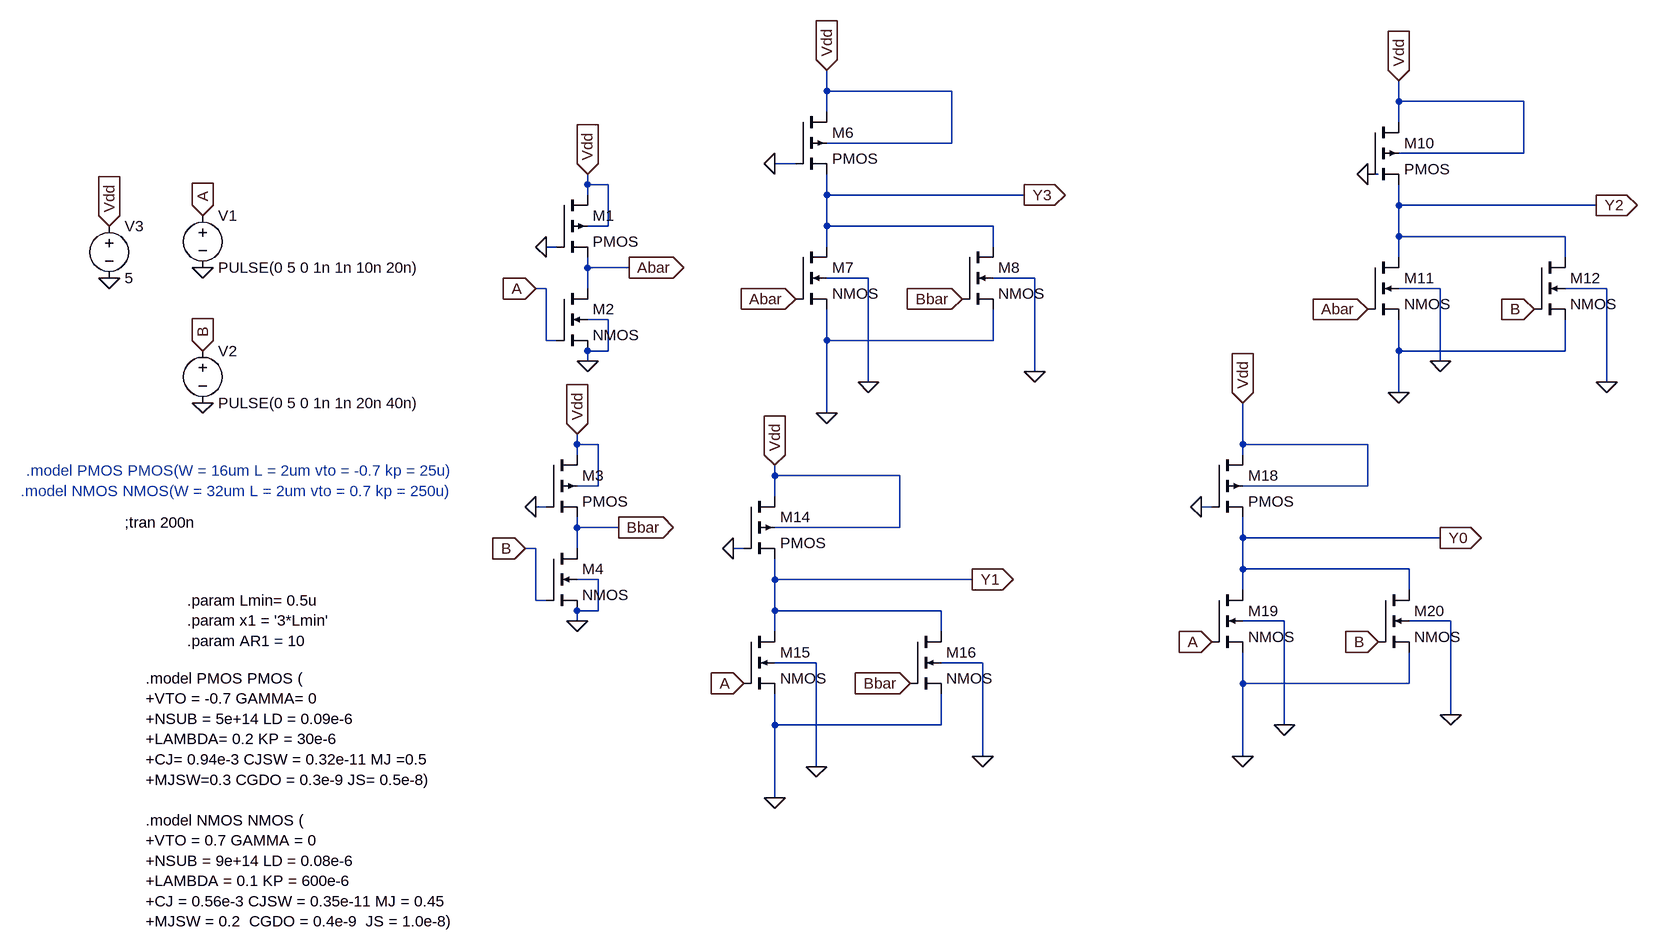
[diagram p0: schematic pseudo nmos 2x4 decoder.asc]
pseudo nmos 2x4 decoder.asc, the LTspice schematic file:
Version 4
SHEET 1 2552 1044
WIRE 928 -496 928 -528
WIRE 1120 -496 928 -496
WIRE 1808 -480 1808 -512
WIRE 2000 -480 1808 -480
WIRE 928 -464 928 -496
WIRE 1808 -448 1808 -480
WIRE 1120 -416 1120 -496
WIRE 1120 -416 928 -416
WIRE 2000 -400 2000 -480
WIRE 2000 -400 1808 -400
WIRE 880 -384 848 -384
WIRE 1776 -368 1760 -368
WIRE 560 -352 560 -368
WIRE 592 -352 560 -352
WIRE 560 -336 560 -352
WIRE 928 -336 928 -368
WIRE 1232 -336 928 -336
WIRE 1808 -320 1808 -352
WIRE 2112 -320 1808 -320
WIRE 592 -288 592 -352
WIRE 592 -288 560 -288
WIRE 928 -288 928 -336
WIRE 1184 -288 928 -288
WIRE 1808 -272 1808 -320
WIRE 2064 -272 1808 -272
WIRE 512 -256 496 -256
WIRE 928 -256 928 -288
WIRE 1184 -256 1184 -288
WIRE 1808 -240 1808 -272
WIRE 2064 -240 2064 -272
WIRE 560 -224 560 -240
WIRE 624 -224 560 -224
WIRE 992 -208 928 -208
WIRE 1248 -208 1184 -208
WIRE 496 -192 480 -192
WIRE 560 -192 560 -224
WIRE 1872 -192 1808 -192
WIRE 2128 -192 2064 -192
WIRE 592 -144 560 -144
WIRE 496 -112 496 -192
WIRE 512 -112 496 -112
WIRE 928 -112 928 -160
WIRE 1184 -112 1184 -160
WIRE 1184 -112 928 -112
WIRE 592 -96 592 -144
WIRE 592 -96 560 -96
WIRE 1808 -96 1808 -144
WIRE 2064 -96 2064 -144
WIRE 2064 -96 1808 -96
WIRE 560 -80 560 -96
WIRE 1872 -80 1872 -192
WIRE 1248 -64 1248 -208
WIRE 992 -48 992 -208
WIRE 2128 -48 2128 -192
WIRE 1808 -32 1808 -96
WIRE 928 0 928 -112
WIRE 544 48 544 32
WIRE 576 48 544 48
WIRE 1568 48 1568 -16
WIRE 1760 48 1568 48
WIRE 544 64 544 48
WIRE 1568 64 1568 48
WIRE 848 96 848 80
WIRE 1040 96 848 96
WIRE 576 112 576 48
WIRE 576 112 544 112
WIRE 1760 112 1760 48
WIRE 1760 112 1568 112
WIRE 848 128 848 96
WIRE 496 144 480 144
WIRE 1520 144 1504 144
WIRE 544 176 544 160
WIRE 608 176 544 176
WIRE 1040 176 1040 96
WIRE 1040 176 848 176
WIRE 1568 192 1568 160
WIRE 1872 192 1568 192
WIRE 480 208 464 208
WIRE 544 208 544 176
WIRE 800 208 784 208
WIRE 1568 240 1568 192
WIRE 1824 240 1568 240
WIRE 576 256 544 256
WIRE 848 256 848 224
WIRE 1152 256 848 256
WIRE 1568 272 1568 240
WIRE 1824 272 1824 240
WIRE 480 288 480 208
WIRE 496 288 480 288
WIRE 576 304 576 256
WIRE 576 304 544 304
WIRE 848 304 848 256
WIRE 1104 304 848 304
WIRE 544 320 544 304
WIRE 1632 320 1568 320
WIRE 1888 320 1824 320
WIRE 848 336 848 304
WIRE 1104 336 1104 304
WIRE 912 384 848 384
WIRE 1168 384 1104 384
WIRE 1568 416 1568 368
WIRE 1824 416 1824 368
WIRE 1824 416 1568 416
WIRE 1888 464 1888 320
WIRE 848 480 848 432
WIRE 1104 480 1104 432
WIRE 1104 480 848 480
WIRE 1632 480 1632 320
WIRE 1168 528 1168 384
WIRE 1568 528 1568 416
WIRE 912 544 912 384
WIRE 848 592 848 480
FLAG 560 -80 0
FLAG 480 -192 A
IOPIN 480 -192 In
FLAG 624 -224 Abar
IOPIN 624 -224 Out
FLAG 560 -368 Vdd
IOPIN 560 -368 In
FLAG -32 -96 B
IOPIN -32 -96 In
FLAG -32 -304 A
IOPIN -32 -304 In
FLAG -32 -224 0
FLAG -32 -16 0
FLAG 544 320 0
FLAG 464 208 B
IOPIN 464 208 In
FLAG 608 176 Bbar
IOPIN 608 176 Out
FLAG 544 32 Vdd
IOPIN 544 32 In
FLAG 928 -528 Vdd
IOPIN 928 -528 In
FLAG 880 -176 Abar
IOPIN 880 -176 In
FLAG 1136 -176 Bbar
IOPIN 1136 -176 In
FLAG 1232 -336 Y3
IOPIN 1232 -336 Out
FLAG -176 -288 Vdd
IOPIN -176 -288 In
FLAG -176 -208 0
FLAG 928 0 0
FLAG 992 -48 0
FLAG 1248 -64 0
FLAG 1808 -512 Vdd
IOPIN 1808 -512 In
FLAG 1760 -160 Abar
IOPIN 1760 -160 In
FLAG 2016 -160 B
IOPIN 2016 -160 In
FLAG 2112 -320 Y2
IOPIN 2112 -320 Out
FLAG 1808 -32 0
FLAG 1872 -80 0
FLAG 2128 -48 0
FLAG 848 80 Vdd
IOPIN 848 80 In
FLAG 800 416 A
IOPIN 800 416 In
FLAG 1056 416 Bbar
IOPIN 1056 416 In
FLAG 1152 256 Y1
IOPIN 1152 256 Out
FLAG 848 592 0
FLAG 912 544 0
FLAG 1168 528 0
FLAG 1568 -16 Vdd
IOPIN 1568 -16 In
FLAG 1520 352 A
IOPIN 1520 352 In
FLAG 1776 352 B
IOPIN 1776 352 In
FLAG 1872 192 Y0
IOPIN 1872 192 Out
FLAG 1568 528 0
FLAG 1632 480 0
FLAG 1888 464 0
FLAG 848 -384 0
FLAG 784 208 0
FLAG 1504 144 0
FLAG 1760 -368 0
FLAG 496 -256 0
FLAG 480 144 0
SYMBOL pmos4 512 -336 R0
SYMATTR InstName M1
SYMATTR Value2 l={Lmin} w={AR1*Lmin} ad={x1*AR1*Lmin} as={x1*AR1*Lmin} pd={2*x1 + 2*AR1*Lmin} ps={2*x1 + 2*AR1*Lmin}
SYMBOL nmos4 512 -192 R0
SYMATTR InstName M2
SYMATTR Value2 l={Lmin} w={AR1*Lmin} ad={x1*AR1*Lmin} as={x1*AR1*Lmin} pd={2*x1 + 2*AR1*Lmin} ps={2*x1 + 2*AR1*Lmin}
SYMBOL voltage -32 -320 R0
WINDOW 123 0 0 Left 0
WINDOW 39 0 0 Left 0
SYMATTR InstName V1
SYMATTR Value PULSE(0 5 0 1n 1n 10n 20n)
SYMBOL voltage -32 -112 R0
WINDOW 123 0 0 Left 0
WINDOW 39 0 0 Left 0
SYMATTR InstName V2
SYMATTR Value PULSE(0 5 0 1n 1n 20n 40n)
SYMBOL pmos4 496 64 R0
SYMATTR InstName M3
SYMATTR Value2 l={Lmin} w={AR1*Lmin} ad={x1*AR1*Lmin} as={x1*AR1*Lmin} pd={2*x1 + 2*AR1*Lmin} ps={2*x1 + 2*AR1*Lmin}
SYMBOL nmos4 496 208 R0
SYMATTR InstName M4
SYMATTR Value2 l={Lmin} w={AR1*Lmin} ad={x1*AR1*Lmin} as={x1*AR1*Lmin} pd={2*x1 + 2*AR1*Lmin} ps={2*x1 + 2*AR1*Lmin}
SYMBOL pmos4 880 -464 R0
SYMATTR InstName M6
SYMATTR Value2 l={Lmin} w={AR1*Lmin} ad={x1*AR1*Lmin} as={x1*AR1*Lmin} pd={2*x1 + 2*AR1*Lmin} ps={2*x1 + 2*AR1*Lmin}
SYMBOL nmos4 880 -256 R0
SYMATTR InstName M7
SYMATTR Value2 l={Lmin} w={2*AR1*Lmin} ad={x1*AR1*Lmin} as={x1*AR1*Lmin} pd={2*x1 + 2*AR1*Lmin} ps={2*x1 + 2*AR1*Lmin}
SYMBOL nmos4 1136 -256 R0
SYMATTR InstName M8
SYMATTR Value2 l={Lmin} w={2*AR1*Lmin} ad={x1*AR1*Lmin} as={x1*AR1*Lmin} pd={2*x1 + 2*AR1*Lmin} ps={2*x1 + 2*AR1*Lmin}
SYMBOL voltage -176 -304 R0
WINDOW 123 0 0 Left 0
WINDOW 39 0 0 Left 0
SYMATTR InstName V3
SYMATTR Value 5
SYMBOL pmos4 1760 -448 R0
SYMATTR InstName M10
SYMATTR Value2 l={Lmin} w={AR1*Lmin} ad={x1*AR1*Lmin} as={x1*AR1*Lmin} pd={2*x1 + 2*AR1*Lmin} ps={2*x1 + 2*AR1*Lmin}
SYMBOL nmos4 1760 -240 R0
SYMATTR InstName M11
SYMATTR Value2 l={Lmin} w={2*AR1*Lmin} ad={x1*AR1*Lmin} as={x1*AR1*Lmin} pd={2*x1 + 2*AR1*Lmin} ps={2*x1 + 2*AR1*Lmin}
SYMBOL nmos4 2016 -240 R0
SYMATTR InstName M12
SYMATTR Value2 l={Lmin} w={2*AR1*Lmin} ad={x1*AR1*Lmin} as={x1*AR1*Lmin} pd={2*x1 + 2*AR1*Lmin} ps={2*x1 + 2*AR1*Lmin}
SYMBOL pmos4 800 128 R0
SYMATTR InstName M14
SYMATTR Value2 l={Lmin} w={AR1*Lmin} ad={x1*AR1*Lmin} as={x1*AR1*Lmin} pd={2*x1 + 2*AR1*Lmin} ps={2*x1 + 2*AR1*Lmin}
SYMBOL nmos4 800 336 R0
SYMATTR InstName M15
SYMATTR Value2 l={Lmin} w={2*AR1*Lmin} ad={x1*AR1*Lmin} as={x1*AR1*Lmin} pd={2*x1 + 2*AR1*Lmin} ps={2*x1 + 2*AR1*Lmin}
SYMBOL nmos4 1056 336 R0
SYMATTR InstName M16
SYMATTR Value2 l={Lmin} w={2*AR1*Lmin} ad={x1*AR1*Lmin} as={x1*AR1*Lmin} pd={2*x1 + 2*AR1*Lmin} ps={2*x1 + 2*AR1*Lmin}
SYMBOL pmos4 1520 64 R0
SYMATTR InstName M18
SYMATTR Value2 l={Lmin} w={AR1*Lmin} ad={x1*AR1*Lmin} as={x1*AR1*Lmin} pd={2*x1 + 2*AR1*Lmin} ps={2*x1 + 2*AR1*Lmin}
SYMBOL nmos4 1520 272 R0
SYMATTR InstName M19
SYMATTR Value2 l={Lmin} w={2*AR1*Lmin} ad={x1*AR1*Lmin} as={x1*AR1*Lmin} pd={2*x1 + 2*AR1*Lmin} ps={2*x1 + 2*AR1*Lmin}
SYMBOL nmos4 1776 272 R0
SYMATTR InstName M20
SYMATTR Value2 l={Lmin} w={2*AR1*Lmin} ad={x1*AR1*Lmin} as={x1*AR1*Lmin} pd={2*x1 + 2*AR1*Lmin} ps={2*x1 + 2*AR1*Lmin}
TEXT -152 168 Left 2 !;tran 200n
TEXT -56 288 Left 2 !.param Lmin= 0.5u\n.param x1 = '3*Lmin'\n.param AR1 = 10
TEXT -120 408 Left 2 !.model PMOS PMOS (\n+VTO = -0.7 GAMMA= 0 \n+NSUB = 5e+14 LD = 0.09e-6 \n+LAMBDA= 0.2 KP = 30e-6\n+CJ= 0.94e-3 CJSW = 0.32e-11 MJ =0.5 \n+MJSW=0.3 CGDO = 0.3e-9 JS= 0.5e-8)\n \n.model NMOS NMOS ( \n+VTO = 0.7 GAMMA = 0 \n+NSUB = 9e+14 LD = 0.08e-6 \n+LAMBDA = 0.1 KP = 600e-6 \n+CJ = 0.56e-3 CJSW = 0.35e-11 MJ = 0.45 \n+MJSW = 0.2  CGDO = 0.4e-9  JS = 1.0e-8)
TEXT -304 88 Left 2 ;.model PMOS PMOS(W = 16um L = 2um vto = -0.7 kp = 25u)
TEXT -312 120 Left 2 ;.model NMOS NMOS(W = 32um L = 2um vto = 0.7 kp = 250u)

The netlist it stands for:
* pseudo nmos 2x4 decoder.asc
M1 Vdd 0 Abar Vdd PMOS l={Lmin} w={AR1*Lmin} ad={x1*AR1*Lmin} as={x1*AR1*Lmin} pd={2*x1 + 2*AR1*Lmin} ps={2*x1 + 2*AR1*Lmin}
M2 Abar A 0 0 NMOS l={Lmin} w={AR1*Lmin} ad={x1*AR1*Lmin} as={x1*AR1*Lmin} pd={2*x1 + 2*AR1*Lmin} ps={2*x1 + 2*AR1*Lmin}
V1 A 0 PULSE(0 5 0 1n 1n 10n 20n)
V2 B 0 PULSE(0 5 0 1n 1n 20n 40n)
M3 Vdd 0 Bbar Vdd PMOS l={Lmin} w={AR1*Lmin} ad={x1*AR1*Lmin} as={x1*AR1*Lmin} pd={2*x1 + 2*AR1*Lmin} ps={2*x1 + 2*AR1*Lmin}
M4 Bbar B 0 0 NMOS l={Lmin} w={AR1*Lmin} ad={x1*AR1*Lmin} as={x1*AR1*Lmin} pd={2*x1 + 2*AR1*Lmin} ps={2*x1 + 2*AR1*Lmin}
M6 Vdd 0 Y3 Vdd PMOS l={Lmin} w={AR1*Lmin} ad={x1*AR1*Lmin} as={x1*AR1*Lmin} pd={2*x1 + 2*AR1*Lmin} ps={2*x1 + 2*AR1*Lmin}
M7 Y3 Abar 0 0 NMOS l={Lmin} w={2*AR1*Lmin} ad={x1*AR1*Lmin} as={x1*AR1*Lmin} pd={2*x1 + 2*AR1*Lmin} ps={2*x1 + 2*AR1*Lmin}
M8 Y3 Bbar 0 0 NMOS l={Lmin} w={2*AR1*Lmin} ad={x1*AR1*Lmin} as={x1*AR1*Lmin} pd={2*x1 + 2*AR1*Lmin} ps={2*x1 + 2*AR1*Lmin}
V3 Vdd 0 5
M10 Vdd 0 Y2 Vdd PMOS l={Lmin} w={AR1*Lmin} ad={x1*AR1*Lmin} as={x1*AR1*Lmin} pd={2*x1 + 2*AR1*Lmin} ps={2*x1 + 2*AR1*Lmin}
M11 Y2 Abar 0 0 NMOS l={Lmin} w={2*AR1*Lmin} ad={x1*AR1*Lmin} as={x1*AR1*Lmin} pd={2*x1 + 2*AR1*Lmin} ps={2*x1 + 2*AR1*Lmin}
M12 Y2 B 0 0 NMOS l={Lmin} w={2*AR1*Lmin} ad={x1*AR1*Lmin} as={x1*AR1*Lmin} pd={2*x1 + 2*AR1*Lmin} ps={2*x1 + 2*AR1*Lmin}
M14 Vdd 0 Y1 Vdd PMOS l={Lmin} w={AR1*Lmin} ad={x1*AR1*Lmin} as={x1*AR1*Lmin} pd={2*x1 + 2*AR1*Lmin} ps={2*x1 + 2*AR1*Lmin}
M15 Y1 A 0 0 NMOS l={Lmin} w={2*AR1*Lmin} ad={x1*AR1*Lmin} as={x1*AR1*Lmin} pd={2*x1 + 2*AR1*Lmin} ps={2*x1 + 2*AR1*Lmin}
M16 Y1 Bbar 0 0 NMOS l={Lmin} w={2*AR1*Lmin} ad={x1*AR1*Lmin} as={x1*AR1*Lmin} pd={2*x1 + 2*AR1*Lmin} ps={2*x1 + 2*AR1*Lmin}
M18 Vdd 0 Y0 Vdd PMOS l={Lmin} w={AR1*Lmin} ad={x1*AR1*Lmin} as={x1*AR1*Lmin} pd={2*x1 + 2*AR1*Lmin} ps={2*x1 + 2*AR1*Lmin}
M19 Y0 A 0 0 NMOS l={Lmin} w={2*AR1*Lmin} ad={x1*AR1*Lmin} as={x1*AR1*Lmin} pd={2*x1 + 2*AR1*Lmin} ps={2*x1 + 2*AR1*Lmin}
M20 Y0 B 0 0 NMOS l={Lmin} w={2*AR1*Lmin} ad={x1*AR1*Lmin} as={x1*AR1*Lmin} pd={2*x1 + 2*AR1*Lmin} ps={2*x1 + 2*AR1*Lmin}
.model NMOS NMOS
.model PMOS PMOS
.lib standard.mos
;tran 200n
.param Lmin= 0.5u
.param x1 = '3*Lmin'
.param AR1 = 10
.model PMOS PMOS (
+VTO = -0.7 GAMMA= 0
+NSUB = 5e+14 LD = 0.09e-6
+LAMBDA= 0.2 KP = 30e-6
+CJ= 0.94e-3 CJSW = 0.32e-11 MJ =0.5
+MJSW=0.3 CGDO = 0.3e-9 JS= 0.5e-8)
.model NMOS NMOS (
+VTO = 0.7 GAMMA = 0
+NSUB = 9e+14 LD = 0.08e-6
+LAMBDA = 0.1 KP = 600e-6
+CJ = 0.56e-3 CJSW = 0.35e-11 MJ = 0.45
+MJSW = 0.2  CGDO = 0.4e-9  JS = 1.0e-8)
* .model PMOS PMOS(W = 16um L = 2um vto = -0.7 kp = 25u)
* .model NMOS NMOS(W = 32um L = 2um vto = 0.7 kp = 250u)
.backanno
.end